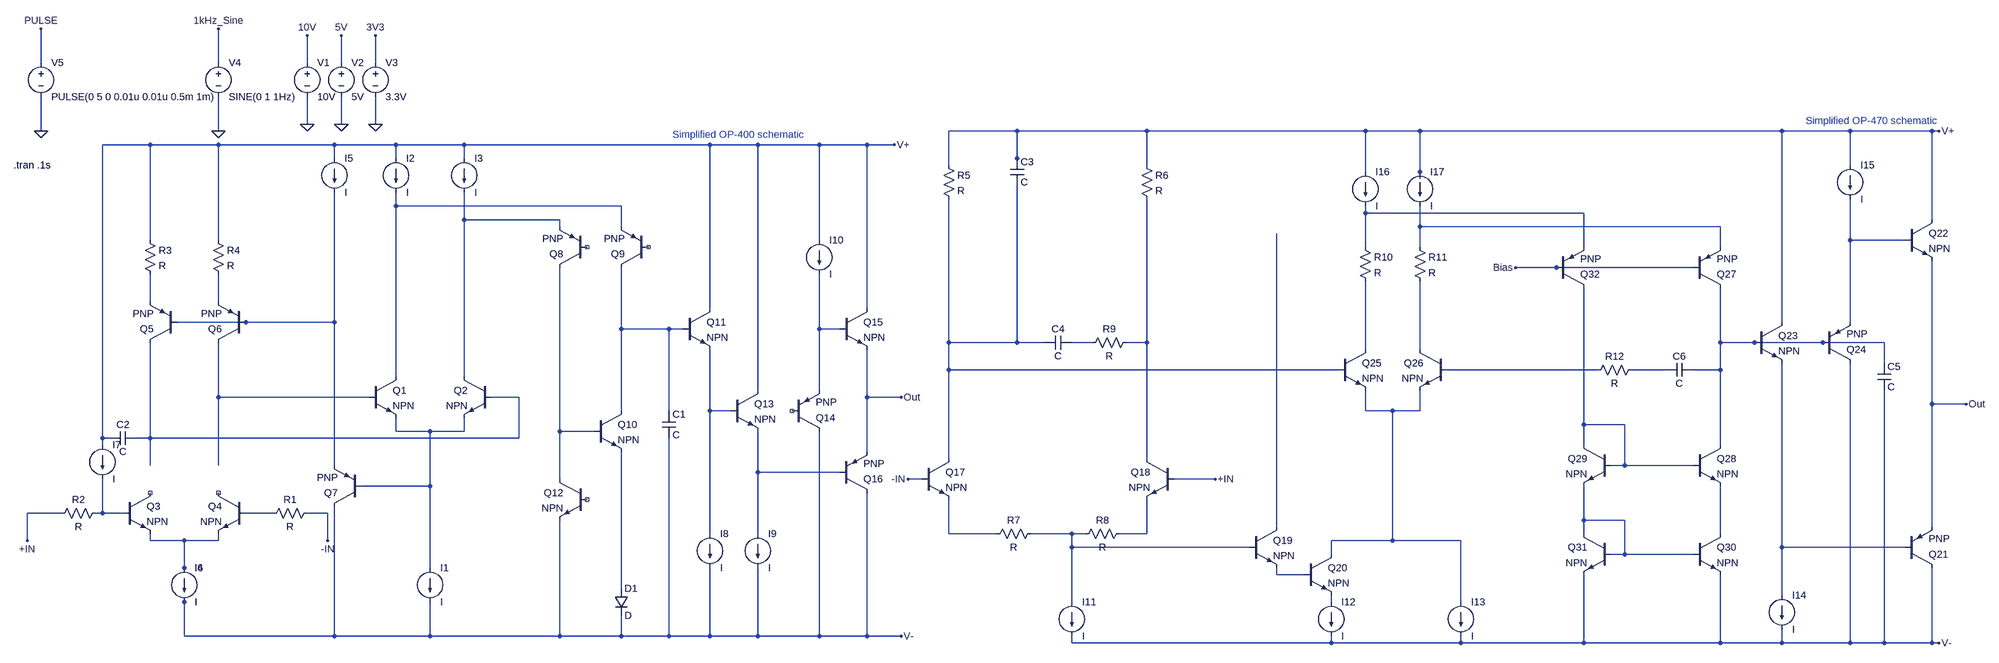
[diagram p0: schematic OpAmp Design.asc]
OpAmp Design.asc, the LTspice schematic file:
Version 4
SHEET 1 4092 2528
WIRE -480 -64 -480 -144
WIRE -64 -64 -64 -144
WIRE 144 -64 144 -128
WIRE 224 -64 224 -128
WIRE 304 -64 304 -128
WIRE 144 80 144 16
WIRE 224 80 224 16
WIRE 304 80 304 16
WIRE -480 96 -480 16
WIRE -64 96 -64 16
WIRE 1808 96 1648 96
WIRE 2112 96 1808 96
WIRE 2624 96 2112 96
WIRE 2752 96 2624 96
WIRE 3600 96 2752 96
WIRE 3760 96 3600 96
WIRE 3952 96 3760 96
WIRE 3968 96 3952 96
WIRE -224 128 -336 128
WIRE -64 128 -224 128
WIRE 208 128 -64 128
WIRE 352 128 208 128
WIRE 512 128 352 128
WIRE 1088 128 512 128
WIRE 1200 128 1088 128
WIRE 1344 128 1200 128
WIRE 1456 128 1344 128
WIRE 1520 128 1456 128
WIRE 208 160 208 128
WIRE 352 160 352 128
WIRE 512 160 512 128
WIRE 1808 160 1808 96
WIRE 1648 176 1648 96
WIRE 1808 176 1808 160
WIRE 2112 176 2112 96
WIRE 3760 176 3760 96
WIRE 2624 192 2624 96
WIRE 2752 192 2752 96
WIRE 2752 208 2752 192
WIRE 352 272 352 240
WIRE 880 272 352 272
WIRE 2624 288 2624 272
WIRE 3136 288 2624 288
WIRE 512 304 512 240
WIRE 736 304 512 304
WIRE 3952 304 3952 96
WIRE 736 320 736 304
WIRE 880 320 880 272
WIRE 2752 320 2752 272
WIRE 3456 320 2752 320
WIRE -224 352 -224 128
WIRE -64 352 -64 128
WIRE 1344 352 1344 128
WIRE 3760 352 3760 256
WIRE 3888 352 3760 352
WIRE 2624 368 2624 288
WIRE 2752 368 2752 320
WIRE 3136 368 3136 288
WIRE 3456 368 3456 320
WIRE 3072 416 2976 416
WIRE 3392 416 3072 416
WIRE -224 496 -224 432
WIRE -64 496 -64 432
WIRE 1088 512 1088 128
WIRE 1456 512 1456 128
WIRE 0 544 -160 544
WIRE 208 544 208 240
WIRE 208 544 0 544
WIRE 3600 544 3600 96
WIRE 3760 544 3760 352
WIRE 880 560 880 416
WIRE 992 560 880 560
WIRE 1024 560 992 560
WIRE 1344 560 1344 432
WIRE 1392 560 1344 560
WIRE 1648 592 1648 256
WIRE 1808 592 1808 224
WIRE 1808 592 1648 592
WIRE 1872 592 1808 592
WIRE 1984 592 1936 592
WIRE 2112 592 2112 256
WIRE 2112 592 2064 592
WIRE 3456 592 3456 464
WIRE 3536 592 3456 592
WIRE 3696 592 3536 592
WIRE 3840 592 3696 592
WIRE 2624 608 2624 448
WIRE 2752 608 2752 448
WIRE 3840 640 3840 592
WIRE 1648 656 1648 592
WIRE 2560 656 1648 656
WIRE 3168 656 2816 656
WIRE 3328 656 3248 656
WIRE 3456 656 3456 592
WIRE 3456 656 3392 656
WIRE 352 672 352 272
WIRE 512 672 512 304
WIRE 1200 704 1200 128
WIRE 1344 704 1344 560
WIRE -64 720 -64 592
WIRE 288 720 -64 720
WIRE 640 720 576 720
WIRE 1456 720 1456 608
WIRE 1536 720 1456 720
WIRE 3952 736 3952 400
WIRE 4032 736 3952 736
WIRE 880 752 880 560
WIRE 992 752 992 560
WIRE 1088 752 1088 608
WIRE 1136 752 1088 752
WIRE 2624 752 2624 704
WIRE 2688 752 2624 752
WIRE 2752 752 2752 704
WIRE 2752 752 2688 752
WIRE 3136 784 3136 464
WIRE 3232 784 3136 784
WIRE 352 800 352 768
WIRE 432 800 352 800
WIRE 512 800 512 768
WIRE 512 800 432 800
WIRE 736 800 736 416
WIRE 816 800 736 800
WIRE -336 816 -336 128
WIRE -320 816 -336 816
WIRE -224 816 -224 592
WIRE -224 816 -256 816
WIRE 640 816 640 720
WIRE 640 816 -224 816
WIRE -336 832 -336 816
WIRE 3136 832 3136 784
WIRE 3456 832 3456 656
WIRE 1456 848 1456 720
WIRE 1648 864 1648 656
WIRE 2112 864 2112 592
WIRE -224 880 -224 816
WIRE -64 880 -64 720
WIRE 208 880 208 544
WIRE 3232 880 3232 784
WIRE 3232 880 3200 880
WIRE 3392 880 3232 880
WIRE 1200 896 1200 800
WIRE 1392 896 1200 896
WIRE 736 912 736 800
WIRE 1584 912 1552 912
WIRE 2272 912 2176 912
WIRE 432 928 432 800
WIRE 432 928 272 928
WIRE -432 992 -512 992
WIRE -336 992 -336 912
WIRE -336 992 -352 992
WIRE -288 992 -336 992
WIRE 64 992 0 992
WIRE 192 992 144 992
WIRE 3136 1008 3136 928
WIRE 3232 1008 3136 1008
WIRE 2416 1024 2416 336
WIRE 3952 1024 3952 736
WIRE 1088 1040 1088 752
WIRE 1200 1040 1200 896
WIRE 1648 1040 1648 960
WIRE 1760 1040 1648 1040
WIRE 1936 1040 1840 1040
WIRE 1968 1040 1936 1040
WIRE 2112 1040 2112 960
WIRE 2112 1040 2048 1040
WIRE 3136 1040 3136 1008
WIRE 3456 1040 3456 928
WIRE -512 1056 -512 992
WIRE -224 1056 -224 1040
WIRE -144 1056 -224 1056
WIRE -64 1056 -64 1040
WIRE -64 1056 -144 1056
WIRE 192 1056 192 992
WIRE 2688 1056 2688 752
WIRE 2688 1056 2544 1056
WIRE 2848 1056 2688 1056
WIRE 1936 1072 1936 1040
WIRE 2352 1072 1936 1072
WIRE 3600 1072 3600 640
WIRE 3888 1072 3600 1072
WIRE 2544 1088 2544 1056
WIRE 3232 1088 3232 1008
WIRE 3232 1088 3200 1088
WIRE 3392 1088 3232 1088
WIRE -144 1120 -144 1056
WIRE 432 1120 432 928
WIRE 2416 1136 2416 1120
WIRE 2480 1136 2416 1136
WIRE 880 1168 880 848
WIRE 3600 1184 3600 1072
WIRE 1936 1200 1936 1072
WIRE 2544 1200 2544 1184
WIRE 2848 1200 2848 1056
WIRE -144 1280 -144 1200
WIRE 208 1280 208 976
WIRE 208 1280 -144 1280
WIRE 432 1280 432 1200
WIRE 432 1280 208 1280
WIRE 736 1280 736 1008
WIRE 736 1280 432 1280
WIRE 880 1280 880 1232
WIRE 880 1280 736 1280
WIRE 992 1280 992 816
WIRE 992 1280 880 1280
WIRE 1088 1280 1088 1120
WIRE 1088 1280 992 1280
WIRE 1200 1280 1200 1120
WIRE 1200 1280 1088 1280
WIRE 1344 1280 1344 800
WIRE 1344 1280 1200 1280
WIRE 1456 1280 1456 944
WIRE 1456 1280 1344 1280
WIRE 1536 1280 1456 1280
WIRE 1936 1296 1936 1280
WIRE 2544 1296 2544 1280
WIRE 2544 1296 1936 1296
WIRE 2848 1296 2848 1280
WIRE 2848 1296 2544 1296
WIRE 3136 1296 3136 1136
WIRE 3136 1296 2848 1296
WIRE 3456 1296 3456 1136
WIRE 3456 1296 3136 1296
WIRE 3600 1296 3600 1264
WIRE 3600 1296 3456 1296
WIRE 3760 1296 3760 640
WIRE 3760 1296 3600 1296
WIRE 3840 1296 3840 704
WIRE 3840 1296 3760 1296
WIRE 3952 1296 3952 1120
WIRE 3952 1296 3840 1296
WIRE 3968 1296 3952 1296
FLAG 144 80 0
FLAG 224 80 0
FLAG 304 80 0
FLAG 304 -128 3V3
FLAG 224 -128 5V
FLAG 144 -128 10V
FLAG -64 96 0
FLAG -64 -144 1kHz_Sine
FLAG -480 96 0
FLAG -480 -144 PULSE
FLAG 1520 128 V+
FLAG 1536 1280 V-
FLAG 192 1056 -IN
FLAG -512 1056 +IN
FLAG 1536 720 Out
FLAG 3968 96 V+
FLAG 3968 1296 V-
FLAG 2272 912 +IN
FLAG 1552 912 -IN
FLAG 4032 736 Out
FLAG 2976 416 Bias
SYMBOL voltage 144 -80 R0
SYMATTR InstName V1
SYMATTR Value 10V
SYMBOL voltage 224 -80 R0
SYMATTR InstName V2
SYMATTR Value 5V
SYMBOL voltage 304 -80 R0
SYMATTR InstName V3
SYMATTR Value 3.3V
SYMBOL voltage -64 -80 R0
WINDOW 123 0 0 Left 0
WINDOW 39 0 0 Left 0
SYMATTR InstName V4
SYMATTR Value SINE(0 1 1Hz)
SYMBOL voltage -480 -80 R0
WINDOW 123 0 0 Left 0
WINDOW 39 0 0 Left 0
SYMATTR InstName V5
SYMATTR Value PULSE(0 5 0 0.01u 0.01u 0.5m 1m)
SYMBOL npn3 288 672 R0
SYMATTR InstName Q1
SYMBOL npn3 576 672 M0
SYMATTR InstName Q2
SYMBOL current 432 1120 R0
SYMATTR InstName I1
SYMBOL current 352 160 R0
SYMATTR InstName I2
SYMBOL current 512 160 R0
SYMATTR InstName I3
SYMBOL current -144 1120 R0
SYMATTR InstName I4
SYMBOL npn3 -288 944 R0
SYMATTR InstName Q3
SYMBOL npn3 0 944 M0
SYMATTR InstName Q4
SYMBOL res 160 976 R90
WINDOW 0 0 56 VBottom 2
WINDOW 3 32 56 VTop 2
SYMATTR InstName R1
SYMBOL res -336 976 R90
WINDOW 0 0 56 VBottom 2
WINDOW 3 32 56 VTop 2
SYMATTR InstName R2
SYMBOL current 208 160 R0
SYMATTR InstName I5
SYMBOL res -240 336 R0
SYMATTR InstName R3
SYMBOL res -80 336 R0
SYMATTR InstName R4
SYMBOL pnp -160 592 R180
SYMATTR InstName Q5
SYMBOL pnp 0 592 R180
SYMATTR InstName Q6
SYMBOL pnp 272 976 R180
SYMATTR InstName Q7
SYMBOL current -144 1120 R0
SYMATTR InstName I6
SYMBOL current -336 832 R0
SYMATTR InstName I7
SYMBOL cap -256 800 R90
WINDOW 0 0 32 VBottom 2
WINDOW 3 32 32 VTop 2
SYMATTR InstName C2
SYMBOL pnp 800 416 R180
SYMATTR InstName Q8
SYMBOL pnp 944 416 R180
SYMATTR InstName Q9
SYMBOL npn 800 912 M0
SYMATTR InstName Q12
SYMBOL npn 816 752 R0
SYMATTR InstName Q10
SYMBOL diode 864 1168 R0
SYMATTR InstName D1
SYMBOL npn 1024 512 R0
SYMATTR InstName Q11
SYMBOL current 1088 1040 R0
SYMATTR InstName I8
SYMBOL npn 1136 704 R0
SYMATTR InstName Q13
SYMBOL current 1200 1040 R0
SYMATTR InstName I9
SYMBOL cap 976 752 R0
SYMATTR InstName C1
SYMBOL pnp 1280 800 M180
SYMATTR InstName Q14
SYMBOL current 1344 352 R0
SYMATTR InstName I10
SYMBOL npn 1392 512 R0
SYMATTR InstName Q15
SYMBOL pnp 1392 944 M180
SYMATTR InstName Q16
SYMBOL res 1632 160 R0
SYMATTR InstName R5
SYMBOL cap 1792 160 R0
SYMATTR InstName C3
SYMBOL res 2096 160 R0
SYMATTR InstName R6
SYMBOL current 1936 1200 R0
SYMATTR InstName I11
SYMBOL current 2544 1200 R0
SYMATTR InstName I12
SYMBOL current 2848 1200 R0
SYMATTR InstName I13
SYMBOL current 3600 1184 R0
SYMATTR InstName I14
SYMBOL npn 1584 864 R0
SYMATTR InstName Q17
SYMBOL npn 2176 864 M0
SYMATTR InstName Q18
SYMBOL res 1856 1024 R90
WINDOW 0 0 56 VBottom 2
WINDOW 3 32 56 VTop 2
SYMATTR InstName R7
SYMBOL res 2064 1024 R90
WINDOW 0 0 56 VBottom 2
WINDOW 3 32 56 VTop 2
SYMATTR InstName R8
SYMBOL cap 1936 576 R90
WINDOW 0 0 32 VBottom 2
WINDOW 3 32 32 VTop 2
SYMATTR InstName C4
SYMBOL res 2080 576 R90
WINDOW 0 0 56 VBottom 2
WINDOW 3 32 56 VTop 2
SYMATTR InstName R9
SYMBOL npn 2352 1024 R0
SYMATTR InstName Q19
SYMBOL npn 2480 1088 R0
SYMATTR InstName Q20
SYMBOL pnp 3888 1120 M180
SYMATTR InstName Q21
SYMBOL npn 3888 304 R0
SYMATTR InstName Q22
SYMBOL npn 3536 544 R0
SYMATTR InstName Q23
SYMBOL current 3760 176 R0
SYMATTR InstName I15
SYMBOL pnp 3696 640 M180
SYMATTR InstName Q24
SYMBOL cap 3824 640 R0
SYMATTR InstName C5
SYMBOL current 2624 192 R0
SYMATTR InstName I16
SYMBOL current 2752 192 R0
SYMATTR InstName I17
SYMBOL res 2608 352 R0
SYMATTR InstName R10
SYMBOL res 2736 352 R0
SYMATTR InstName R11
SYMBOL npn 2560 608 R0
SYMATTR InstName Q25
SYMBOL npn 2816 608 M0
SYMATTR InstName Q26
SYMBOL res 3264 640 R90
WINDOW 0 0 56 VBottom 2
WINDOW 3 32 56 VTop 2
SYMATTR InstName R12
SYMBOL cap 3392 640 R90
WINDOW 0 0 32 VBottom 2
WINDOW 3 32 32 VTop 2
SYMATTR InstName C6
SYMBOL pnp 3392 464 M180
SYMATTR InstName Q27
SYMBOL npn 3392 832 R0
SYMATTR InstName Q28
SYMBOL npn 3200 832 M0
SYMATTR InstName Q29
SYMBOL npn 3392 1040 R0
SYMATTR InstName Q30
SYMBOL npn 3200 1040 M0
SYMATTR InstName Q31
SYMBOL pnp 3072 464 M180
SYMATTR InstName Q32
TEXT -544 176 Left 2 !.tran .1s
TEXT 1000 104 Left 2 ;Simplified OP-400 schematic
TEXT 3656 72 Left 2 ;Simplified OP-470 schematic

The netlist it stands for:
* OpAmp Design.asc
V1 10V 0 10V
V2 5V 0 5V
V3 3V3 0 3.3V
V4 1kHz_Sine 0 SINE(0 1 1Hz)
V5 PULSE 0 PULSE(0 5 0 0.01u 0.01u 0.5m 1m)
Q1 N001 N019 N024 0 NPN
Q2 N003 N020 N024 0 NPN
I1 N024 V- I
I2 V+ N001 I
I3 V+ N003 I
I4 N035 V- I
Q3 NC_01 N027 N035 0 NPN
Q4 NC_02 N028 N035 0 NPN
R1 -IN N028 R
R2 N027 +IN R
I5 V+ N008 I
R3 V+ N006 R
R4 V+ N007 R
Q5 N020 N008 N006 0 PNP
Q6 N019 N008 N007 0 PNP
Q7 V- N024 N008 0 PNP
I6 N035 V- I
I7 V+ N027 I
C2 N020 V+ C
Q8 N025 NC_03 N003 0 PNP
Q9 N009 NC_04 N001 0 PNP
Q12 N025 NC_05 V- 0 NPN
Q10 N009 N025 N038 0 NPN
D1 N038 V- D
Q11 V+ N009 N021 0 NPN
I8 N021 V- I
Q13 V+ N021 N026 0 NPN
I9 N026 V- I
C1 N009 V- C
Q14 V- NC_06 N010 0 PNP
I10 V+ N010 I
Q15 V+ N010 Out 0 NPN
Q16 V- N026 Out 0 PNP
R5 V+ N011 R
C3 V+ N011 C
R6 V+ N013 R
I11 N032 V- I
I12 N039 V- I
I13 N022 V- I
I14 N036 V- I
Q17 N011 -IN N031 0 NPN
Q18 N013 +IN N033 0 NPN
R7 N032 N031 R
R8 N033 N032 R
C4 N012 N011 C
R9 N013 N012 R
Q19 N030 N032 N037 0 NPN
Q20 N022 N037 N039 0 NPN
Q21 V- N036 Out 0 PNP
Q22 V+ N005 Out 0 NPN
Q23 V+ N014 N036 0 NPN
I15 V+ N005 I
Q24 V- N014 N005 0 PNP
C5 N014 V- C
I16 V+ N002 I
I17 V+ N004 I
R10 N002 N015 R
R11 N004 N016 R
Q25 N015 N011 N022 0 NPN
Q26 N016 N017 N022 0 NPN
R12 N018 N017 R
C6 N014 N018 C
Q27 N014 Bias N004 0 PNP
Q28 N014 N023 N034 0 NPN
Q29 N023 N023 N029 0 NPN
Q30 N034 N029 V- 0 NPN
Q31 N029 N029 V- 0 NPN
Q32 N023 Bias N002 0 PNP
.model D D
.lib standard.dio
.model NPN NPN
.model PNP PNP
.lib standard.bjt
.tran .1s
* Simplified OP-400 schematic
* Simplified OP-470 schematic
.backanno
.end